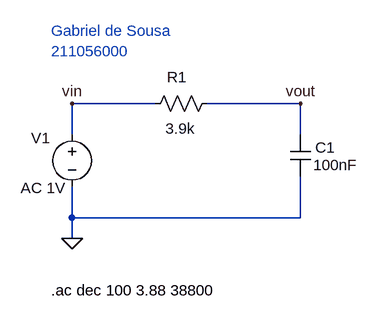
[diagram p0: schematic item_3.asc]
item_3.asc, the LTspice schematic file:
Version 4.1
SHEET 1 880 680
WIRE 256 32 128 32
WIRE 480 32 336 32
WIRE 128 80 128 32
WIRE 480 80 480 32
WIRE 128 208 128 160
WIRE 480 208 480 144
WIRE 480 208 128 208
WIRE 128 240 128 208
FLAG 128 240 0
FLAG 128 32 vin
FLAG 480 32 vout
SYMBOL voltage 128 64 R0
WINDOW 0 -63 21 Left 2
WINDOW 3 24 152 Left 2
WINDOW 123 -79 98 Left 2
WINDOW 39 0 0 Left 0
SYMATTR InstName V1
SYMATTR Value ""
SYMATTR Value2 AC 1V
SYMBOL res 352 16 R90
WINDOW 0 -9 62 VBottom 2
WINDOW 3 39 57 VTop 2
SYMATTR InstName R1
SYMATTR Value 3.9k
SYMBOL cap 464 80 R0
WINDOW 0 39 20 Left 2
WINDOW 3 36 47 Left 2
SYMATTR InstName C1
SYMATTR Value 100nF
TEXT 96 320 Left 2 !.ac dec 100 3.88 38800
TEXT 96 -80 Left 2 ;Gabriel de Sousa\n211056000

The netlist it stands for:
* item_3.asc
V1 vin 0 AC 1V
R1 vout vin 3.9k
C1 vout 0 100nF
.ac dec 100 3.88 38800
* Gabriel de Sousa
* 211056000
.backanno
.end